# Altium schematic sheet Intelligent_Agriculture_Wifi.SchDoc
size A4
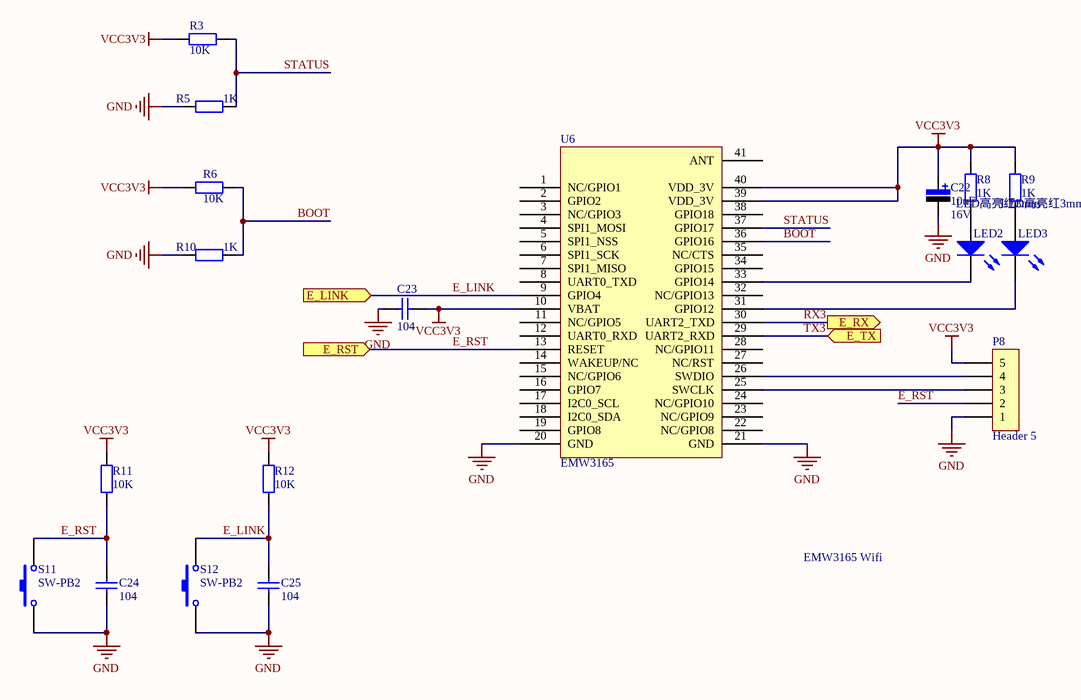
[diagram p0: Intelligent_Agriculture_Wifi.SchDoc]

## Parts
C22  value 10uF  Vol: 16V  [CAP-3528]  (hidden comment: Cap Pol)
C23  value 104  [C-RAD-0805]  (hidden comment: Cap)
C24  value 104  [C-RAD-0805]  (hidden comment: Cap)
C25  value 104  [C-RAD-0805]  (hidden comment: Cap)
LED2  LED0  [LED_A2]  (value not drawn)
LED3  LED0  [LED_A2]  (value not drawn)
P8  Header 5  [HDR5_A1]
R3  value 10K  [0805-1]  (hidden comment: Res1)
R5  value 1K  [0805-1]  (hidden comment: Res1)
R6  value 10K  [0805-1]  (hidden comment: Res1)
R8  value 1K  [0805-1]  (hidden comment: Res1)
R9  value 1K  [0805-1]  (hidden comment: Res1)
R10  value 1K  [0805-1]  (hidden comment: Res1)
R11  value 10K  [0805-1]  (hidden comment: Res1)
R12  value 10K  [0805-1]  (hidden comment: Res1)
S11  SW-PB2  [SW_PB2-S-3*6*2.5]
S12  SW-PB2  [SW_PB2-S-3*6*2.5]
U6  EMW3165  [EMW3165]

## Ports
E_LINK (in), E_RST (in), E_RX (out), E_TX (in)

## Nets
GND: C22.2 C23.1 C24.2 C25.2 P8.1 R5.2 R10.2 S11.1 S12.1 U6.20(GND) U6.21(GND)
VCC3V3: C22.1 C23.2 P8.5 R3.2 R6.2 R8.2 R9.2 R11.1 R12.2 U6.10(VBAT) U6.39(VDD_3V) U6.40(VDD_3V)
BOOT: R6.1 R10.1 U6.36(GPIO16)
E_LINK: C25.1 R12.1 S12.2 U6.9(GPIO4) ; port E_LINK
E_RST: C24.1 P8.2 R11.2 S11.2 U6.13(RESET) ; port E_RST
RX3: U6.30(UART2_TXD) ; port E_RX
STATUS: R3.1 R5.1 U6.37(GPIO17)
TX3: U6.29(UART2_RXD) ; port E_TX
NetLED2_1: LED2.1(A) R8.1
NetLED2_2: LED2.2(K) U6.33(GPIO14)
NetLED3_1: LED3.1(A) R9.1
NetLED3_2: LED3.2(K) U6.31(GPIO12)
NetP8_3: P8.3 U6.25(SWCLK)
NetP8_4: P8.4 U6.26(SWDIO)

Not connected (* = marked no-connect by the designer): U6 1(NC/GPIO1) 2(GPIO2) 3(NC/GPIO3) 4(SPI1_MOSI) 5(SPI1_NSS) 6(SPI1_SCK) 7(SPI1_MISO) 8(UART0_TXD) 11(NC/GPIO5) 12(UART0_RXD) 14(WAKEUP/NC) 15(NC/GPIO6) 16(GPIO7) 17(I2C0_SCL) 18(I2C0_SDA) 19(GPIO8) 22(NC/GPIO8) 23(NC/GPIO9) 24(NC/GPIO10) 27(NC/RST) 28(NC/GPIO11) 32(NC/GPIO13) 34(GPIO15) 35(NC/CTS) 38(GPIO18) 41(ANT)

## Notes on the sheet
- EMW3165 Wifi
- (in symbol LED0) LED高亮红3mm

## Library data of the parts
C22 = Cap P: 钽电容; Published: 8-Jun-2000; LatestRevisionDate: 17-Jul-2002; LatestRevisionNote: Re-released for DXP Platform.; PackageReference: RB7.6-15; Publisher: Altium Limited
C23-C25 = Cap: 无极性电容; Published: 8-Jun-2000; LatestRevisionDate: 17-Jul-2002; LatestRevisionNote: Re-released for DXP Platform.; PackageReference: RAD-0.3; Publisher: Altium Limited
LED2 LED3 = LED0: 发光二极管; Published: 8-Jun-2000; LatestRevisionDate: 08-Jul-2005; LatestRevisionNote: Mech Layer 1 removed.; PackageReference: LED-0; Publisher: Altium Limited
P8 = Head: 接插件; Value: 排针; LatestRevisionDate: 17-Jul-2002; LatestRevisionNote: Re-released for DXP Platform.; Publisher: Altium Limited
R3 R5 R6 R8-R12 = Res1: 贴片电阻; Published: 8-Jun-2000; LatestRevisionDate: 17-Jul-2002; LatestRevisionNote: Re-released for DXP Platform.; PackageReference: AXIAL-0.4; Publisher: Altium Limited
S11 S12 = SW-: 微动开关; Value: 6*6*5mm; Published: 24-Mar-1999; LatestRevisionDate: 17-Jul-2002; LatestRevisionNote: Re-released for DXP Platform.; PackageReference: SPST-2; Publisher: Altium Limited; Value: Value
U6 = EMW3165: WIFI 模块